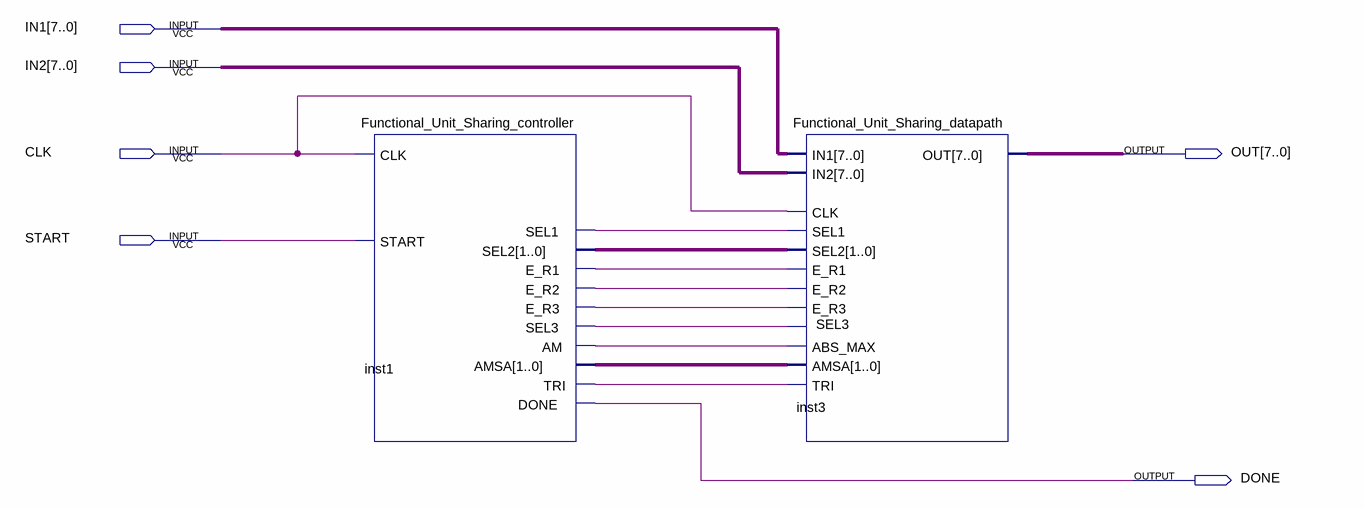
[diagram p0: schematic sheet]
// Quartus schematic Functional_Unit_Sharing.bdf as structural Verilog: 2 symbols, 6 pins
module Functional_Unit_Sharing (
  input  [7:0] IN1,
  input  [7:0] IN2,
  input  CLK,
  input  START,
  output [7:0] OUT,
  output DONE
);

  wire inst1_am, inst1_e_r1, inst1_e_r2, inst1_e_r3, inst1_sel1, inst1_sel3, inst1_tri;
  wire [1:0] inst1_amsa, inst1_sel2;

  Functional_Unit_Sharing_controller inst1 (
    .CLK(CLK), .START(START), .SEL1(inst1_sel1), .SEL2(inst1_sel2), .E_R1(inst1_e_r1), .E_R2(inst1_e_r2),
    .E_R3(inst1_e_r3), .SEL3(inst1_sel3), .AM(inst1_am), .AMSA(inst1_amsa), .TRI(inst1_tri), .DONE(DONE));
  Functional_Unit_Sharing_datapath inst3 (
    .CLK(CLK), .IN1(IN1), .IN2(IN2), .SEL1(inst1_sel1), .SEL2(inst1_sel2), .SEL3(inst1_sel3),
    .E_R1(inst1_e_r1), .E_R2(inst1_e_r2), .E_R3(inst1_e_r3), .ABS_MAX(inst1_am), .AMSA(inst1_amsa),
    .TRI(inst1_tri), .OUT(OUT));
endmodule
